# Altium schematic sheet SYSTEM BLOCK.SchDoc
size A3; CheckedBy: Alain.Zhu; CompanyName: TYMPHANY; DrawnBy: Yetta.He; Organization: PABU-BL3; Address1: 11F,block A, CEC building,; Address2: No.2070 Shennan Zhong road,; Address3: Huaqiang North, Futian District,; Address4: Shenzhen,  Guang Dong, P.R.C 518000; DocumentNumber: 1; Revision: 1.0.0; SheetNumber: 1; SheetTotal: 8; Size: A3; PCB By: Yetta.He; Status: DP1.1
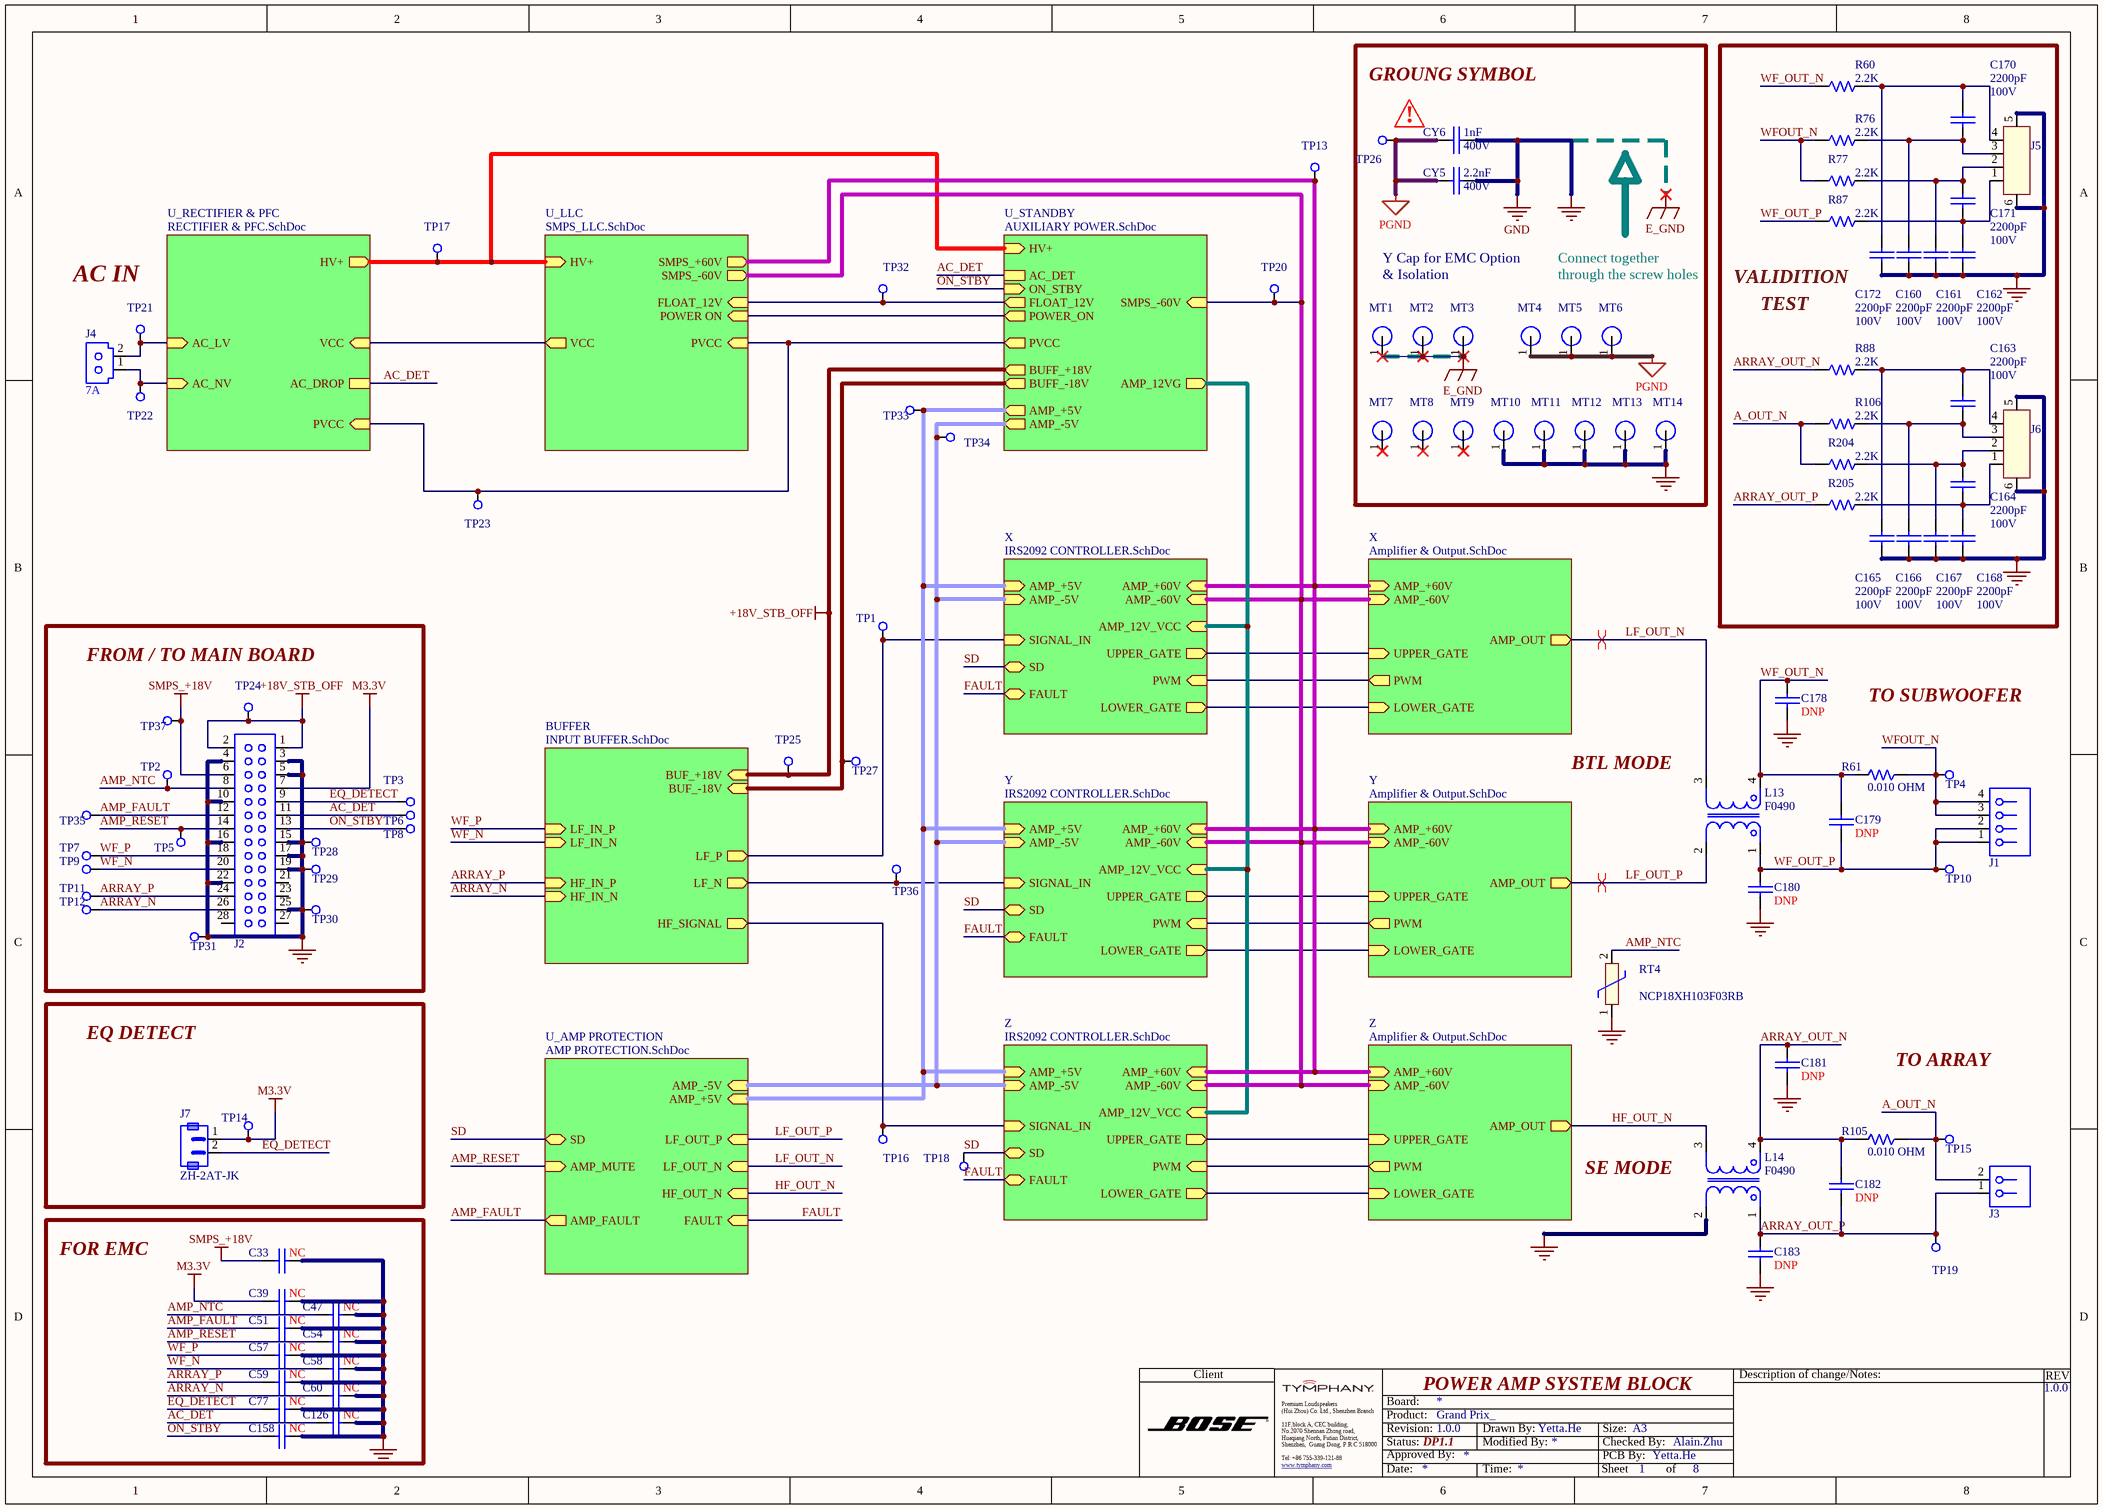
[diagram p0: SYSTEM BLOCK.SchDoc]

## Parts
*?  Important Sign  (value not drawn)  (graphical)
C33  value NC  [CAPC0603-RW]  (hidden comment: CAP0603 NC)
C39  value NC  [CAPC0603-RW]  (hidden comment: CAP0603 NC)
C47  value NC  [CAPC0603-RW]  (hidden comment: CAP0603 NC)
C51  value NC  [CAPC0603-RW]  (hidden comment: CAP0603 NC)
C54  value NC  [CAPC0603-RW]  (hidden comment: CAP0603 NC)
C57  value NC  [CAPC0603-RW]  (hidden comment: CAP0603 NC)
C58  value NC  [CAPC0603-RW]  (hidden comment: CAP0603 NC)
C59  value NC  [CAPC0603-RW]  (hidden comment: CAP0603 NC)
C60  value NC  [CAPC0603-RW]  (hidden comment: CAP0603 NC)
C77  value NC  [CAPC0603-RW]  (hidden comment: CAP0603 NC)
C126  value NC  [CAPC0603-RW]  (hidden comment: CAP0603 NC)
C158  value NC  [CAPC0603-RW]  (hidden comment: CAP0603 NC)
C160  value 2200pF  Voltage: 100V  [CAPC0402-RW]  (hidden comment: T542012227608)
C161  value 2200pF  Voltage: 100V  [CAPC0402-RW]  (hidden comment: T542012227608)
C162  value 2200pF  Voltage: 100V  [CAPC0402-RW]  (hidden comment: T542012227608)
C163  value 2200pF  Voltage: 100V  [CAPC0402-RW]  (hidden comment: T542012227608)
C164  value 2200pF  Voltage: 100V  [CAPC0402-RW]  (hidden comment: T542012227608)
C165  value 2200pF  Voltage: 100V  [CAPC0402-RW]  (hidden comment: T542012227608)
C166  value 2200pF  Voltage: 100V  [CAPC0402-RW]  (hidden comment: T542012227608)
C167  value 2200pF  Voltage: 100V  [CAPC0402-RW]  (hidden comment: T542012227608)
C168  value 2200pF  Voltage: 100V  [CAPC0402-RW]  (hidden comment: T542012227608)
C170  value 2200pF  Voltage: 100V  [CAPC0402-RW]  (hidden comment: T542012227608)
C171  value 2200pF  Voltage: 100V  [CAPC0402-RW]  (hidden comment: T542012227608)
C172  value 2200pF  Voltage: 100V  [CAPC0402-RW]  (hidden comment: T542012227608)
C178  value DNP  [CAPC0603-RW]  (hidden comment: CAP0603 NC)
C179  value DNP  [CAPC0603-RW]  (hidden comment: CAP0603 NC)
C180  value DNP  [CAPC0603-RW]  (hidden comment: CAP0603 NC)
C181  value DNP  [CAPC0603-RW]  (hidden comment: CAP0603 NC)
C182  value DNP  [CAPC0603-RW]  (hidden comment: CAP0603 NC)
C183  value DNP  [CAPC0603-RW]  (hidden comment: CAP0603 NC)
CY5  value 2.2nF  Voltage: 400V  [CAP_NP_DISC_T6.0D9.0LH13P10]  (hidden comment: T564222414040)
CY6  value 1nF  Voltage: 400V  [CAP_NP_DISC_T6.0D7.0LH11P10]  (hidden comment: CAP SAFETY 1nF 400V 20% Y1 - TDK_CD45)
J1  T690300164300  [CONN 4P PH=3.96mm_VH-4AW-CS]  (value not drawn)
J2  T690300165400  [HEAD 28P 2X14 PH=2.54mm ST 2.54-2x14A-45.8A]  (value not drawn)
J3  T690300164200  [CONN 2P PH=3.96mm_VH-2AW-CS]  (value not drawn)
J4  Current: 7A  [CONN 2P PH=3.96mm RM Mid-PIN_JINJIA_VH-3A2-01]  (hidden comment: T690300109500)
J5  T690300062400  [CONN 4P PH=1.25mm ST SMT-Cvilux]  (value not drawn)
J6  T690300062400  [CONN 4P PH=1.25mm ST SMT-Cvilux]  (value not drawn)
J7  MFG Part: ZH-2AT-JK  [CONN 2P PH=1.5MM SMT 180 ZH-2AT-JK]  (hidden comment: T690300108700)
L13  MFG Part: F0490  [IND F0490 T16*8*15]  (hidden comment: T621000061200)
L14  MFG Part: F0490  [IND F0490 T16*8*15]  (hidden comment: T621000061200)
MT1  MT 3.5mm hole  [MT 3.5mm hole]  (value not drawn)
MT2  MT 3.5mm hole  [MT 3.5mm hole]  (value not drawn)
MT3  MT 3.5mm hole  [MT 3.5mm hole]  (value not drawn)
MT4  MT 3.5mm/5mm  [MT 3.5mm]  (value not drawn)
MT5  MT 3.5mm/5mm  [MT 3.5mm]  (value not drawn)
MT6  MT 3.5mm/5mm  [MT 3.5mm]  (value not drawn)
MT7  MT 3.5mm hole  [MT 3.5mm hole]  (value not drawn)
MT8  MT 3.5mm hole  [MT 3.5mm hole]  (value not drawn)
MT9  MT 3.5mm hole  [MT 3.5mm hole]  (value not drawn)
MT10  MT 3.5mm/5mm  [MT 3.5mm]  (value not drawn)
MT11  MT 3.5mm/5mm  [MT 3.5mm]  (value not drawn)
MT12  MT 3.5mm/5mm  [MT 3.5mm]  (value not drawn)
MT13  MT 3.5mm/5mm  [MT 3.5mm]  (value not drawn)
MT14  MT 3.5mm/5mm  [MT 3.5mm]  (value not drawn)
R60  value 2.2K  [0402-RW]  (hidden comment: QCF161240-2201)
R61  value 0.010 OHM  [1206-RW]  (hidden comment: QCF101010-1006)
R76  value 2.2K  [0402-RW]  (hidden comment: QCF161240-2201)
R77  value 2.2K  [0402-RW]  (hidden comment: QCF161240-2201)
R87  value 2.2K  [0402-RW]  (hidden comment: QCF161240-2201)
R88  value 2.2K  [0402-RW]  (hidden comment: QCF161240-2201)
R105  value 0.010 OHM  [1206-RW]  (hidden comment: QCF101010-1006)
R106  value 2.2K  [0402-RW]  (hidden comment: QCF161240-2201)
R204  value 2.2K  [0402-RW]  (hidden comment: QCF161240-2201)
R205  value 2.2K  [0402-RW]  (hidden comment: QCF161240-2201)
RT4  RNT000030-1002  [0603]  (value not drawn)
TP1  TP  [tp_1.2mm]  (value not drawn)
TP2  TP  [tp_1.2mm]  (value not drawn)
TP3  TP  [tp_1.2mm]  (value not drawn)
TP4  TP  [tp_1.2mm]  (value not drawn)
TP5  TP  [tp_1.2mm]  (value not drawn)
TP6  TP  [tp_1.2mm]  (value not drawn)
TP7  TP  [tp_1.2mm]  (value not drawn)
TP8  TP  [tp_1.2mm]  (value not drawn)
TP9  TP  [tp_1.2mm]  (value not drawn)
TP10  TP  [tp_1.2mm]  (value not drawn)
TP11  TP  [tp_1.2mm]  (value not drawn)
TP12  TP  [tp_1.2mm]  (value not drawn)
TP13  TP  [tp_1.2mm]  (value not drawn)
TP14  TP  [tp_1.2mm]  (value not drawn)
TP15  TP  [tp_1.2mm]  (value not drawn)
TP16  TP  [tp_1.2mm]  (value not drawn)
TP17  TP  [tp_1.2mm]  (value not drawn)
TP18  TP  [tp_1.2mm]  (value not drawn)
TP19  TP  [tp_1.2mm]  (value not drawn)
TP20  TP  [tp_1.2mm]  (value not drawn)
TP21  TP  [tp_1.2mm]  (value not drawn)
TP22  TP  [tp_1.2mm]  (value not drawn)
TP23  TP  [tp_1.2mm]  (value not drawn)
TP24  TP  [tp_1.2mm]  (value not drawn)
TP25  TP  [tp_1.2mm]  (value not drawn)
TP26  TP  [tp_1.2mm]  (value not drawn)
TP27  TP  [tp_1.2mm]  (value not drawn)
TP28  TP  [tp_1.2mm]  (value not drawn)
TP29  TP  [tp_1.2mm]  (value not drawn)
TP30  TP  [tp_1.2mm]  (value not drawn)
TP31  TP  [tp_1.2mm]  (value not drawn)
TP32  TP  [tp_1.2mm]  (value not drawn)
TP33  TP  [tp_1.2mm]  (value not drawn)
TP34  TP  [tp_1.2mm]  (value not drawn)
TP35  TP  [tp_1.2mm]  (value not drawn)
TP36  TP  [tp_1.2mm]  (value not drawn)
TP37  TP  [tp_1.2mm]  (value not drawn)

## Blocks framed on the sheet
GROUNG SYMBOL: *? CY5 CY6 MT1-MT14 TP26
FROM / TO MAIN BOARD: J2 TP2 TP3 TP5-TP9 TP11 TP12 TP24 TP28-TP31 TP35 TP37
EQ DETECT: J7 TP14
FOR EMC: C33 C39 C47 C51 C54 C57-C60 C77 C126 C158

## Sub-sheets
BUFFER = INPUT BUFFER.SchDoc: LF_P (out), LF_IN_P (in), LF_IN_N (in), HF_SIGNAL (out), LF_N (out), HF_IN_P (in), HF_IN_N (in), BUF_+18V (in), BUF_-18V (in)
U_AMP PROTECTION = AMP PROTECTION.SchDoc: SD (bidir), LF_OUT_P (in), LF_OUT_N (in), HF_OUT_N (in), AMP_MUTE (in), AMP_-5V (in), AMP_FAULT (out), FAULT (in), AMP_+5V (in)
U_LLC = SMPS_LLC.SchDoc: HV+ (in), PVCC (in), POWER ON (in), VCC (out), SMPS_+60V (out), SMPS_-60V (out), FLOAT_12V (in)
U_RECTIFIER & PFC = RECTIFIER & PFC.SchDoc: HV+ (out), VCC (in), PVCC (in), AC_LV (in), AC_NV (in), AC_DROP
U_STANDBY = AUXILIARY POWER.SchDoc: HV+ (in), ON_STBY (in), POWER_ON (out), PVCC (out), AC_DET, AMP_+5V (out), AMP_-5V (out), AMP_12VG (out), BUFF_+18V (out), BUFF_-18V (out), FLOAT_12V (out), SMPS_-60V (in)
X = IRS2092 CONTROLLER.SchDoc: SIGNAL_IN (in), UPPER_GATE (out), PWM (in), LOWER_GATE (out), SD (bidir), AMP_+5V (in), AMP_-5V (in), AMP_12V_VCC (in), AMP_-60V (in), AMP_+60V (in), FAULT (bidir)
X = Amplifier & Output.SchDoc: UPPER_GATE (in), LOWER_GATE (in), PWM (out), AMP_OUT (out), AMP_+60V (in), AMP_-60V (in)
Y = IRS2092 CONTROLLER.SchDoc: SIGNAL_IN (in), UPPER_GATE (out), PWM (in), LOWER_GATE (out), SD (bidir), AMP_+5V (in), AMP_-5V (in), AMP_12V_VCC (in), AMP_+60V (in), AMP_-60V (in), FAULT (bidir)
Y = Amplifier & Output.SchDoc: UPPER_GATE (in), LOWER_GATE (in), PWM (out), AMP_OUT (out), AMP_-60V (in), AMP_+60V (in)
Z = IRS2092 CONTROLLER.SchDoc: SIGNAL_IN (in), UPPER_GATE (out), PWM (in), LOWER_GATE (out), SD (bidir), AMP_+5V (in), AMP_-5V (in), AMP_12V_VCC (in), AMP_-60V (in), AMP_+60V (in), FAULT (bidir)
Z = Amplifier & Output.SchDoc: UPPER_GATE (in), LOWER_GATE (in), PWM (out), AMP_OUT (out), AMP_+60V (in), AMP_-60V (in)

## Nets
+18V_STB_OFF: J2.1 J2.2 TP24.1 TP25.1 ; sheet BUFFER/BUF_+18V, sheet U_STANDBY/BUFF_+18V
E_GND: MT1.1 MT2.1 MT3.1
GND: C33.2 C39.2 C47.2 C51.2 C54.2 C57.2 C58.2 C59.2 C60.2 C77.2 C126.2 C158.2 C160.2 C161.2 C162.2 C165.2 C166.2 C167.2 C168.2 C172.2 C178.1 C180.2 C181.1 C183.2 CY5.2 CY6.2 J2.3 J2.4 J2.5 J2.10 J2.15 J2.16 J2.17 J2.19 J2.22 J2.25 J5.5 J5.6 J6.5 J6.6 L14.2 MT10.1(Plate) MT11.1(Plate) MT12.1(Plate) MT13.1(Plate) MT14.1(Plate) RT4.1 TP28.1 TP29.1 TP30.1 TP31.1
M3.3V: C39.1 J2.7 J7.1 TP14.1
PGND: CY5.1 CY6.1 MT4.1(Plate) MT5.1(Plate) MT6.1(Plate) TP26.1
SMPS_+18V: C33.1 J2.6 TP37.1
A_OUT_N: J3.2 R105.1 R106.1 R204.1 TP15.1
AC_DET: C126.1 J2.11 TP6.1 ; sheet U_RECTIFIER & PFC/AC_DROP, sheet U_STANDBY/AC_DET
AMP_FAULT: C51.1 J2.12 TP35.1 ; sheet U_AMP PROTECTION/AMP_FAULT
AMP_NTC: C47.1 J2.8 RT4.2 TP2.1
AMP_RESET: C54.1 J2.14 TP5.1 ; sheet U_AMP PROTECTION/AMP_MUTE
ARRAY_N: C60.1 J2.26 TP12.1 ; sheet BUFFER/HF_IN_N
ARRAY_OUT_N: C181.2 C182.1 L14.4 R88.1 R105.2
ARRAY_OUT_P: C182.2 C183.1 J3.1 L14.1 R205.1 TP19.1
ARRAY_P: C59.1 J2.24 TP11.1 ; sheet BUFFER/HF_IN_P
EQ_DETECT: C77.1 J2.9 J7.2 TP3.1
FAULT: sheet X/FAULT, sheet Y/FAULT, sheet Z/FAULT, sheet U_AMP PROTECTION/FAULT
HF_OUT_N: L14.3 ; sheet Z/AMP_OUT, sheet U_AMP PROTECTION/HF_OUT_N
LF_OUT_N: L13.3 ; sheet X/AMP_OUT, sheet U_AMP PROTECTION/LF_OUT_N
LF_OUT_P: L13.2 ; sheet Y/AMP_OUT, sheet U_AMP PROTECTION/LF_OUT_P
ON_STBY: C158.1 J2.13 TP8.1 ; sheet U_STANDBY/ON_STBY
SD: TP18.1 ; sheet X/SD, sheet Y/SD, sheet Z/SD, sheet U_AMP PROTECTION/SD
WF_N: C58.1 J2.20 TP9.1 ; sheet BUFFER/LF_IN_N
WF_OUT_N: C178.2 C179.1 L13.4 R60.1 R61.2
WF_OUT_P: C179.2 C180.1 J1.1 J1.2 L13.1 R87.1 TP10.1
WF_P: C57.1 J2.18 TP7.1 ; sheet BUFFER/LF_IN_P
WFOUT_N: J1.3 J1.4 R61.1 R76.1 R77.1 TP4.1
NetC160_1: C160.1 C170.2 J5.3 R76.2
NetC161_1: C161.1 C171.1 J5.2 R77.2
NetC162_1: C162.1 C171.2 J5.1 R87.2
NetC163_1: C163.1 C165.1 J6.4 R88.2
NetC163_2: C163.2 C166.1 J6.3 R106.2
NetC164_1: C164.1 C167.1 J6.2 R204.2
NetC164_2: C164.2 C168.1 J6.1 R205.2
NetC170_1: C170.1 C172.1 J5.4 R60.2
NetJ4_1: J4.1 TP22.1 ; sheet U_RECTIFIER & PFC/AC_NV
NetJ4_2: J4.2 TP21.1 ; sheet U_RECTIFIER & PFC/AC_LV
NetTP1_1: TP1.1 ; sheet X/SIGNAL_IN, sheet BUFFER/LF_P
NetTP13_1: TP13.1 ; sheet X/AMP_+60V, sheet Y/AMP_+60V, sheet Z/AMP_+60V, sheet X/AMP_+60V, sheet Y/AMP_+60V, sheet Z/AMP_+60V, sheet U_LLC/SMPS_+60V
NetTP16_1: TP16.1 ; sheet BUFFER/HF_SIGNAL, sheet Z/SIGNAL_IN
NetTP17_1: TP17.1 ; sheet U_RECTIFIER & PFC/HV+, sheet U_LLC/HV+, sheet U_STANDBY/HV+
NetTP20_1: TP20.1 ; sheet X/AMP_-60V, sheet Y/AMP_-60V, sheet Z/AMP_-60V, sheet X/AMP_-60V, sheet Y/AMP_-60V, sheet Z/AMP_-60V, sheet U_LLC/SMPS_-60V, sheet U_STANDBY/SMPS_-60V
NetTP23_1: TP23.1 ; sheet U_RECTIFIER & PFC/PVCC, sheet U_LLC/PVCC, sheet U_STANDBY/PVCC
NetTP27_1: TP27.1 ; sheet BUFFER/BUF_-18V, sheet U_STANDBY/BUFF_-18V
NetTP32_1: TP32.1 ; sheet U_LLC/FLOAT_12V, sheet U_STANDBY/FLOAT_12V
NetTP33_1: TP33.1 ; sheet X/AMP_+5V, sheet Y/AMP_+5V, sheet Z/AMP_+5V, sheet U_STANDBY/AMP_+5V, sheet U_AMP PROTECTION/AMP_+5V
NetTP34_1: TP34.1 ; sheet X/AMP_-5V, sheet Y/AMP_-5V, sheet Z/AMP_-5V, sheet U_STANDBY/AMP_-5V, sheet U_AMP PROTECTION/AMP_-5V
NetTP36_1: TP36.1 ; sheet BUFFER/LF_N, sheet Y/SIGNAL_IN
(unnamed): sheet X/UPPER_GATE, sheet X/UPPER_GATE
(unnamed): sheet X/PWM, sheet X/PWM
(unnamed): sheet X/LOWER_GATE, sheet X/LOWER_GATE
(unnamed): sheet X/AMP_12V_VCC, sheet Y/AMP_12V_VCC, sheet Z/AMP_12V_VCC, sheet U_STANDBY/AMP_12VG
(unnamed): sheet Y/UPPER_GATE, sheet Y/UPPER_GATE
(unnamed): sheet Y/PWM, sheet Y/PWM
(unnamed): sheet Y/LOWER_GATE, sheet Y/LOWER_GATE
(unnamed): sheet Z/UPPER_GATE, sheet Z/UPPER_GATE
(unnamed): sheet Z/PWM, sheet Z/PWM
(unnamed): sheet Z/LOWER_GATE, sheet Z/LOWER_GATE
(unnamed): sheet U_RECTIFIER & PFC/VCC, sheet U_LLC/VCC
(unnamed): sheet U_LLC/POWER ON, sheet U_STANDBY/POWER_ON

Not connected (* = marked no-connect by the designer): J2 21 23 27 28; MT7 1*; MT8 1*; MT9 1*

## Layout directives
differential pair: LF_OUT_N, LF_OUT_P

## Notes on the sheet
- (near TP21) AC IN
- Y Cap for EMC Option & Isolation
- Connect together through the screw holes
- VALIDITION
- TEST
- TO SUBWOOFER
- BTL MODE
- TO ARRAY
- (near L14) SE MODE
- POWER AMP SYSTEM BLOCK
- Labels drawn without touching a wire or pin: E_GND
- Client
- Description of change/Notes:
- REV
- Premium Loudspeakers
- (Hui Zhou) Co. Ltd., Shenzhen Branch
- Tel: +86 755-339-121-88
- Board:
- Status:
- Revision:
- Product:
- Approved By:
- Grand Prix_
- Drawn By:
- Modified By:
- Checked By:
- PCB By:
- Size:
- www.tymphany.com <http://www.tymphany.com>
- Date:
- Time:
- Sheet
- of
- (in symbol Important Sign) !

## Library data of the parts
C33 C39 C47 C51 C54 C57-C60 C77 C126 C158 C178-C183 = CAP0603 NC: NC; Type: Capacitor; CREATE_NAME: Tom; DIP&SMD: SMD; SAP: *; PACKAGE: CAPC0603; Vendor Code: *; Vendor Name: *; MFG: *; MFG Part: *; Other: *; Tolerance: *; CREATE_TIME: 18-Mar-2016; Voltage: *; Customer Specific: N/A
C160-C168 C170-C172 = CAP0402 2200pF 100V 10%_X7R_WALSIN: CAP X7R 2200P 100V +-10% 0402 WALSIN L; MFG Part: 0402B222K101; Tolerance: 10%; Type: Capacitor; DIP&SMD: SMD; CREATE_NAME: Nathan; SAP: T542012227608; PACKAGE: CAPC0402; Vendor Name: *; MFG: WALSIN; Other: X7R; Customer Specific: N/A; CREATE_TIME: 20-Nov-2018
CY5 = CAP SAFETY 2.2nF 400V 20% Y1 - TDK_CD45: PLS-DIP 2200PF 400V +-20% D CD45-E2G K; MFG Part: CD45-E2GA222M-NKA; MFG: TDK; Tolerance: 20%; CREATE_NAME: Nathan; DIP&SMD: DIP; SAP: T564222414040; PACKAGE: 2.2nF\400V; Vendor Name: *; Vendor Code: *; Other: *; CREATE_TIME: 12-Nov-2018; Type: Capacitor; Customer Specific: N/A
CY6 = CAP SAFETY 1nF 400V 20% Y1 - TDK_CD45: Cap, Ceramic, Safety-Rated Y1, 1nF; MFG Part: CD45-E2GA102M-NKA; SAP: T564102414030; MFG: TDK; Tolerance: 10%; CREATE_NAME: Nathan; DIP&SMD: DIP; PACKAGE: 1nF\400V; Vendor Name: *; Vendor Code: *; Other: *; CREATE_TIME: 12-Nov-2018; Type: Capacitor; Customer Specific: N/A
J1 = CONN 4P PH=3.96mm RA VH-4AW-CS: CONN 4P P3.96 M90 WHITE K; Value: 3.96mm; MFG: JINJIA; DIP&SMD: DIP; CREATE_NAME: Cherry; SAP: T690300164300; MFG Part: VH-4AW-CS; Vendor Name: *; Vendor Code: *; Type: Connector; Current: *; CREATE_TIME: 2019-04-10
J2 = HEAD 28P 2X14 PH=2.54mm ST 2.54-2x14A-45.8A: CONN 2X14P P2.54 M180 H45.8 K; Value: 2.54mm; MFG: JIN JIA; CREATE_NAME: Nathan; Current: 3A; DIP&SMD: DIP; SAP: T690300165400; MFG Part: 2.54-2x14A-45.8A; Vendor Name: *; Vendor Code: *; Type: Connector; CREATE_TIME: 15-Apr-2019; Customer Specific: N/A
J3 = CONN 2P PH=3.96mm RA VH-2AW-CS: CONN 2P P3.96 M90 WHITE K; Value: 3.96mm; MFG: JIN JIA; CREATE_NAME: Cherry; DIP&SMD: DIP; SAP: T690300164200; MFG Part: VH-2AW-CS; Type: Connector; Current: *; CREATE_TIME: 2019-04-09
J4 = CONN 2P PH=3.96mm RM Mid-PIN_JINJIA_VH-3A2-01: CONNECTOR 2PIN 3.96MM DIP 180 K; CREATE_NAME: Nathan; Value: 3.96mm; SAP: T690300109500; MFG: *; MFG Part: *; Vendor Name: *; Vendor Code: *; Type: Connector; DIP&SMD: DIP; CREATE_TIME: 12-Sep-2017
J5 J6 = CONN 4P PH=1.25mm ST SMT-Cvilux: CON\CI4404M_1.25MM_VL G; MFG Part: CI4404M1VR0-NH; MFG: Cvilux; Value: 1.25mm; CREATE_NAME: Tom; DIP&SMD: SMD; SAP: T690300062400; Vendor Name: *; Vendor Code: *; Tolerance: *; Type: Connector; CREATE_TIME: 25-Feb-2016
J7 = CONN 2P PH=1.5MM SMT 180 ZH-2AT-JK: CONNECTOR 2PIN 1.5MM SMT 90 K; CREATE_NAME: Nathan; MFG: JINJIA; CURRENT: 1.5A; DIP&SMD: SMD; CREATE_TIME: 12-Sep-2017; SAP: T690300108700; Vendor Name: *; Vendor code: *; Type: *; Package: *
L13 L14 = IND 17uH F0490: 17UH N/A 1KHZ DIP SUNSHI F0490 K; MFG: SUNSHINE; DCR: 6.0mohm; Type: INDUCTOR; CREATE_Name: Nathan; SAP: T621000061200; Test Frequency: *; Vendor Code: *; Vendor Name: *; Tolerance: *; CREATE_Time: 18-May-2018; Value: 17uH; DIP&SMD: DIP
R60 R76 R77 R87 R88 R106 R204 R205 = RES0402 1/16W 1% 2.2K OHM-QCF161240-2201: CHIP RES 2.2K OHM 1/16W 1% 0402; SAP: T502220101399; CREATE_NAME: Evan@Deftronics; DIP&SMD: SMD; Vendor Code: *; Power: 1/16W; Vendor Name: *; MFG Part: *; MFG: *; TOL: 1%; Type: Resistor; CREATE_TIME: 23-Apr-2014; PACKAGE: 0402; Customer Specific: N/A
R61 R105 = RES1206 1W 1% 0.010 OHM: RES, 0.010 OHM, 1W, 1%, 1206, RoHS; SAP: T502100D043G9; DIP&SMD: SMD; CREATE_NAME: TOM@Deftronics; Vendor Code: *; Power: 1W; Vendor Name: *; MFG Part: *; MFG: *; TOL: 1%; Type: Resistor; Package: 1206; Customer Specific: N/A; CREATE_TIME: 13-May-2014
RT4 = NCP18XH103F03RB: NTC 10k Ohm 1%,0603, MURATA; Vendor Code: 10010061; Vendor Name: 深圳市海能达科技发展有限公司; SAP: T710600007400; MFG: Murata; Value: 10K; Package: 0603; Type: NTC; MFG Part: NCP18XH103F03RB
TP1-TP37 = TP: DIP&SMD: TP; Customer Specific: N/A